# Altium schematic sheet LoraWAN_Node.SchDoc
size 381 x 381 mm; SheetNumber: 1; SheetTotal: 1
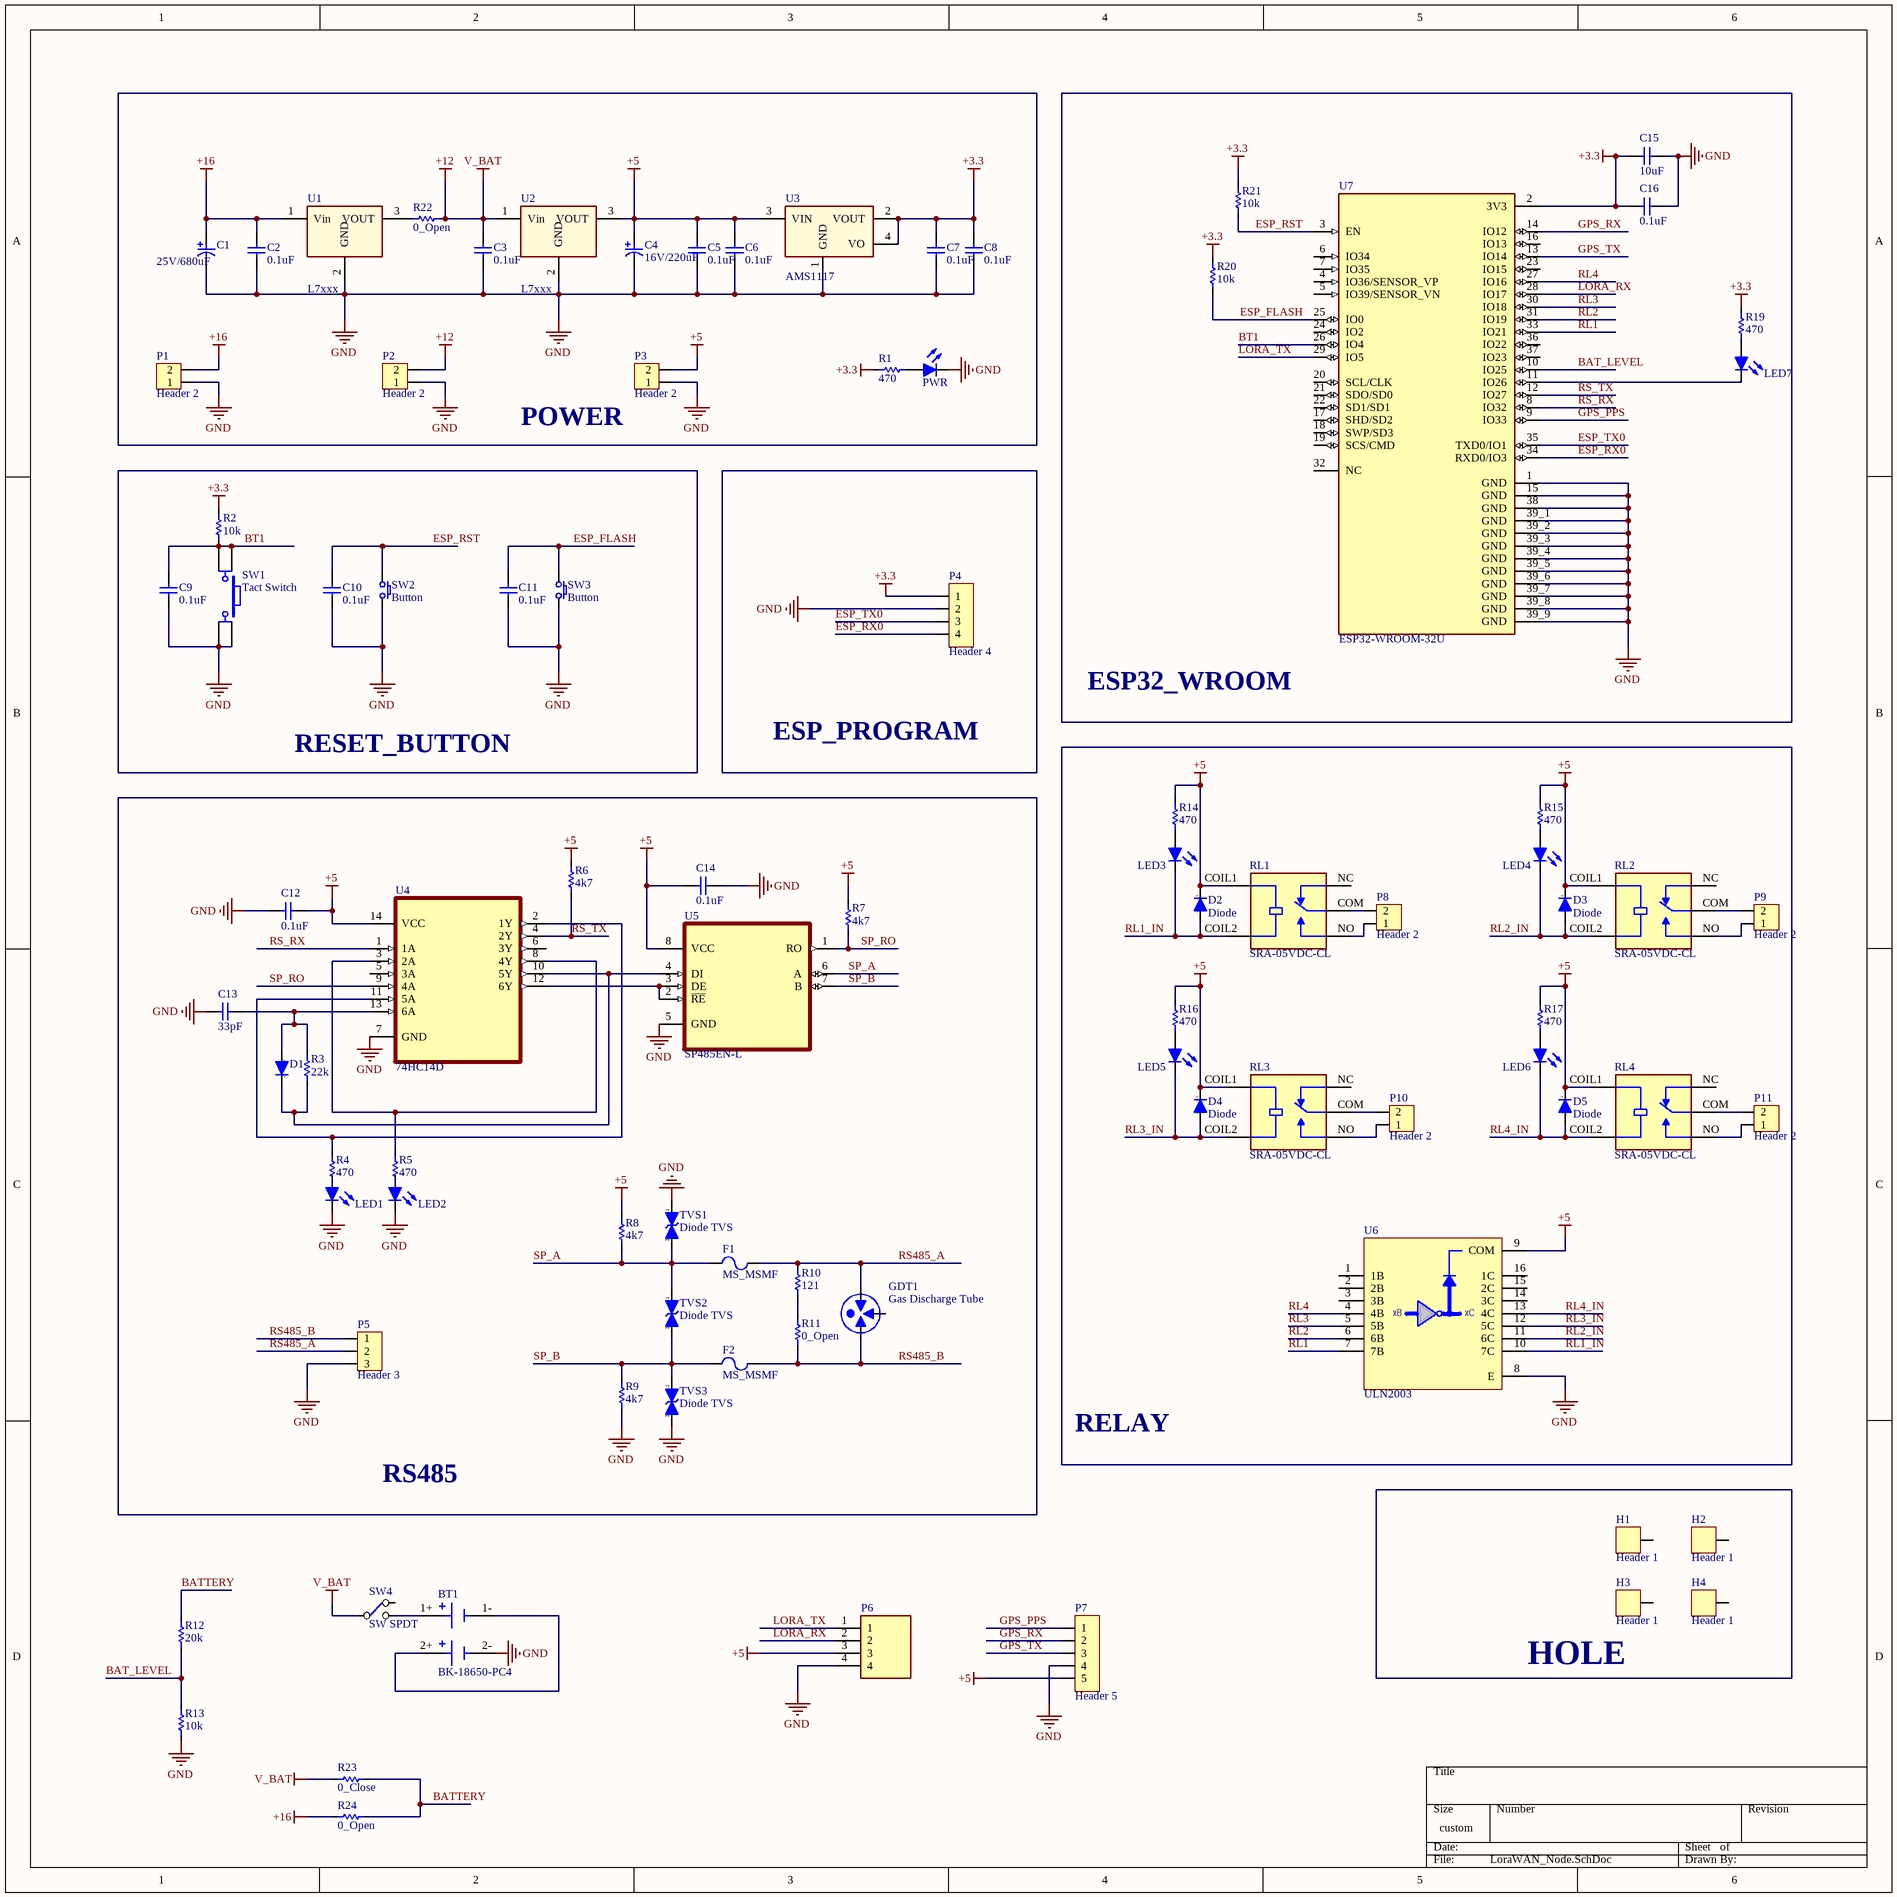
[diagram p0: LoraWAN_Node.SchDoc]

## Parts
BT1  BK-18650-PC4  [BAT_BK-18650-PC4]
C1  25V/680uF  [C SMD ALU (G)]
C2  0.1uF  [C 0603 (1608)]
C3  0.1uF  [C 0603 (1608)]
C4  16V/220uF  [C SMD ALU (D8)]
C5  0.1uF  [C 0603 (1608)]
C6  0.1uF  [C 0603 (1608)]
C7  0.1uF  [C 0603 (1608)]
C8  0.1uF  [C 0603 (1608)]
C9  0.1uF  [C 0603 (1608)]
C10  0.1uF  [C 0603 (1608)]
C11  0.1uF  [C 0603 (1608)]
C12  0.1uF  [C 0603 (1608)]
C13  33pF  [C 0603 (1608)]
C14  0.1uF  [C 0603 (1608)]
C15  10uF  [C 0603 (1608)]
C16  0.1uF  [C 0603 (1608)]
D1  Diode  [DO-214AC (SMA)]  (value not drawn)
D2  Diode  [DO-214AC (SMA)]
D3  Diode  [DO-214AC (SMA)]
D4  Diode  [DO-214AC (SMA)]
D5  Diode  [DO-214AC (SMA)]
F1  MS_MSMF  [Fuse 1812P050]
F2  MS_MSMF  [Fuse 1812P050]
GDT1  Gas Discharge Tube  [CAPC4532X110N]
H1  Header 1  [M3]
H2  Header 1  [M3]
H3  Header 1  [M3]
H4  Header 1  [M3]
LED1  Led  [Led SMD 0805]  (value not drawn)
LED2  Led  [Led SMD 0805]  (value not drawn)
LED3  Led  [Led SMD 0805]  (value not drawn)
LED4  Led  [Led SMD 0805]  (value not drawn)
LED5  Led  [Led SMD 0805]  (value not drawn)
LED6  Led  [Led SMD 0805]  (value not drawn)
LED7  Led  [Led SMD 0805]  (value not drawn)
P1  Header 2  [XH2.54-2P]
P2  Header 2  [HDR Domino 2 - 5MM]
P3  Header 2  [HDR Domino 2 - 5MM]
P4  Header 4  [Header 4]
P5  Header 3  [HDR Domino 3 - 5MM]
P6  110990030  [SEEED_110990030]  (value not drawn)
P7  Header 5  [Header 5]
P8  Header 2  [HDR Domino 2 - 5MM]
P9  Header 2  [HDR Domino 2 - 5MM]
P10  Header 2  [HDR Domino 2 - 5MM]
P11  Header 2  [HDR Domino 2 - 5MM]
PWR  Led  [Led SMD 0805]  (value not drawn)
R1  470  [R 0603 (1608)]
R2  10k  [R 0603 (1608)]
R3  22k  [R 0603 (1608)]
R4  470  [R 0603 (1608)]
R5  470  [R 0603 (1608)]
R6  4k7  [R 0603 (1608)]
R7  4k7  [R 0603 (1608)]
R8  4k7  [R 0603 (1608)]
R9  4k7  [R 0603 (1608)]
R10  121  [R 0603 (1608)]
R11  0_Open  [R 0603 (1608)]
R12  20k  [R 0603 (1608)]
R13  10k  [R 0603 (1608)]
R14  470  [R 0603 (1608)]
R15  470  [R 0603 (1608)]
R16  470  [R 0603 (1608)]
R17  470  [R 0603 (1608)]
R19  470  [R 0603 (1608)]
R20  10k  [R 0603 (1608)]
R21  10k  [R 0603 (1608)]
R22  0_Open  [R 0603 (1608)]
R23  0_Close  [R 0603 (1608)]
R24  0_Open  [R 0603 (1608)]
RL1  SRA-05VDC-CL  [RELAY_SRA-05VDC-CL]
RL2  SRA-05VDC-CL  [RELAY_SRA-05VDC-CL]
RL3  SRA-05VDC-CL  [RELAY_SRA-05VDC-CL]
RL4  SRA-05VDC-CL  [RELAY_SRA-05VDC-CL]
SW1  Tact Switch  [SW/4/DIP/SMALL]
SW2  Button  [SW/2/SMD]
SW3  Button  [SW/2/SMD]
SW4  SW SPDT  [SW/3/SPDT/SS12D10]
TVS1  Diode TVS  [DO-214AA (SMB)]
TVS2  Diode TVS  [DO-214AA (SMB)]
TVS3  Diode TVS  [DO-214AA (SMB)]
U1  L7xxx  [TO-263 (D2PAK)]
U2  L7xxx  [TO-263 (D2PAK)]
U3  AMS1117  [SOT-223]
U4  74HC14D  [SOIC127P600X175-14N]
U5  SP485EN-L  [SOIC-8]
U6  ULN2003  [SOIC-16]
U7  ESP32-WROOM-32U  [XCVR_ESP32-WROOM-32U]

## Nets
+3.3: C7.1 C8.1 C15.1 C16.1 P4.1 R1.2 R2.2 R19.2 R20.2 R21.2 U3.2(VOUT) U3.4(VO) U7.2(3V3)
+5: C4.1 C5.1 C6.1 C12.2 C14.1 D2.1(Cathode) D3.1(Cathode) D4.1(Cathode) D5.1(Cathode) P3.2 P6.3 P7.5 R6.2 R7.2 R8.2 R14.2 R15.2 R16.2 R17.2 RL1.COIL1 RL2.COIL1 RL3.COIL1 RL4.COIL1 U2.3(VOUT) U3.3(VIN) U4.14(VCC) U5.8(VCC) U6.9(COM)
+12: C3.1 P2.2 R22.1 R23.2 SW4.2(COMMON1) U2.1(Vin)  [also labelled V_BAT]
+16: C1.1 C2.1 P1.2 R24.2 U1.1(Vin)
GND: BT1.2- C1.2 C2.2 C3.2 C4.2 C5.2 C6.2 C7.2 C8.2 C9.2 C10.2 C11.2 C12.1 C13.1 C14.2 C15.2 C16.2 LED1.1(K) LED2.1(K) P1.1 P2.1 P3.1 P4.2 P5.3 P6.4 P7.4 PWR.1(K) R9.1 R13.1 SW1.2 SW1.3 SW2.2 SW3.2 TVS1.1(A) TVS3.2(K) U1.2(GND) U2.2(GND) U3.1(GND) U4.7(GND) U5.5(GND) U6.8(E) U7.1(GND) U7.15(GND) U7.38(GND) U7.39_1(GND) U7.39_2(GND) U7.39_3(GND) U7.39_4(GND) U7.39_5(GND) U7.39_6(GND) U7.39_7(GND) U7.39_8(GND) U7.39_9(GND)
BAT_LEVEL: R12.1 R13.2 U7.10(IO25)
BATTERY: R12.2 R23.1 R24.1
BT1: C9.1 R2.1 SW1.1 SW1.4 U7.26(IO4)
ESP_FLASH: C11.1 R20.1 SW3.1 U7.25(IO0)
ESP_RST: C10.1 R21.1 SW2.1 U7.3(EN)
ESP_RX0: P4.4 U7.34(RXD0/IO3)
ESP_TX0: P4.3 U7.35(TXD0/IO1)
GPS_PPS: P7.1 U7.9(IO33)
GPS_RX: P7.2 U7.14(IO12)
GPS_TX: P7.3 U7.13(IO14)
LORA_RX: P6.2 U7.28(IO17)
LORA_TX: P6.1 U7.29(IO5)
RL1: U6.7(7B) U7.33(IO21)
RL1_IN: D2.2(Anode) LED3.1(K) RL1.COIL2 U6.10(7C)
RL2: U6.6(6B) U7.31(IO19)
RL2_IN: D3.2(Anode) LED4.1(K) RL2.COIL2 U6.11(6C)
RL3: U6.5(5B) U7.30(IO18)
RL3_IN: D4.2(Anode) LED5.1(K) RL3.COIL2 U6.12(5C)
RL4: U6.4(4B) U7.27(IO16)
RL4_IN: D5.2(Anode) LED6.1(K) RL4.COIL2 U6.13(4C)
RS485_A: F1.2 GDT1.1 P5.2 R10.1
RS485_B: F2.2 GDT1.2 P5.1 R11.2
RS_RX: U4.1(1A) U7.8(IO32)
RS_TX: R6.1 U4.4(2Y) U7.12(IO27)
SP_A: F1.1 R8.1 TVS1.2(K) TVS2.1(A) U5.6(A)
SP_B: F2.1 R9.2 TVS2.2(K) TVS3.1(A) U5.7(B)
SP_RO: R7.1 U4.9(4A) U5.1(RO)
NetBT1_1+: BT1.1+ SW4.3(NO1)
NetBT1_1-: BT1.1- BT1.2+
NetC13_2: C13.2 D1.2(Anode) R3.2 U4.13(6A)
NetD1_1: D1.1(Cathode) R3.1 U4.10(5Y) U5.4(DI)
NetLED1_2: LED1.2(A) R4.1
NetLED2_2: LED2.2(A) R5.1
NetLED3_2: LED3.2(A) R14.1
NetLED4_2: LED4.2(A) R15.1
NetLED5_2: LED5.2(A) R16.1
NetLED6_2: LED6.2(A) R17.1
NetLED7_1: LED7.1(K) U7.11(IO26)
NetLED7_2: LED7.2(A) R19.1
NetP8_1: P8.1 RL1.NO
NetP8_2: P8.2 RL1.COM
NetP9_1: P9.1 RL2.NO
NetP9_2: P9.2 RL2.COM
NetP10_1: P10.1 RL3.NO
NetP10_2: P10.2 RL3.COM
NetP11_1: P11.1 RL4.NO
NetP11_2: P11.2 RL4.COM
NetPWR_2: PWR.2(A) R1.1
NetR4_2: R4.2 U4.2(1Y) U4.11(5A)
NetR5_2: R5.2 U4.3(2A) U4.8(4Y)
NetR10_2: R10.2 R11.1
NetR22_2: R22.2 U1.3(VOUT)
NetU4_12: U4.12(6Y) U5.2(~{RE}) U5.3(DE)

Not connected (* = marked no-connect by the designer): GDT1 3; H1 1; H2 1; H3 1; H4 1; RL1 NC; RL2 NC; RL3 NC; RL4 NC; SW4 1(NC1); U4 5(3A) 6(3Y); U6 1(1B) 2(2B) 3(3B) 14(3C) 15(2C) 16(1C); U7 4(IO36/SENSOR_VP) 5(IO39/SENSOR_VN) 6(IO34) 7(IO35) 16(IO13) 17(SHD/SD2) 18(SWP/SD3) 19(SCS/CMD) 20(SCL/CLK) 21(SDO/SD0) 22(SD1/SD1) 23(IO15) 24(IO2) 32(NC) 36(IO22) 37(IO23)

## Notes on the sheet
- POWER
- ESP32_WROOM
- RESET_BUTTON
- ESP_PROGRAM
- RELAY
- RS485
- HOLE
- (in symbol Diode) k; a
- (in symbol ULN2003) xB; xC

## Library data of the parts
BT1 = BK-18650-PC4: Battery Holder (Open) 18650 2 Cell PC Pin; Price: None; Value: *; Package: None; Availability: Unavailable; MP: BK-18650-PC4
C1 C4 = Capacitor: Capacitor pol
C2 C3 C5-C16 = Capacitor NP: Capacitor non-pol
D1-D5 = Diode: Default Diode; Published: 8-Jun-2000; LatestRevisionDate: 17-Jul-2002; LatestRevisionNote: Re-released for DXP Platform.; PackageVersion: Sep-1996; PackageReference: SMC; Publisher: Altium Limited; Code_JEDEC: DO-214-AB
F1 F2 = Fuse
H1-H4 = Header 1: Header, 1-Pin; LatestRevisionDate: 17-Jul-2002; LatestRevisionNote: Re-released for DXP Platform.; Publisher: Altium Limited
LED1-LED7 PWR = Led: Typical LED
P1-P3 P8-P11 = Header 2: Header, 2-Pin; LatestRevisionDate: 17-Jul-2002; LatestRevisionNote: Re-released for DXP Platform.; Publisher: Altium Limited
P4 = Header 4: Header, 4-Pin
P5 = Header 3: Header, 3-Pin
P6 = 110990030: MF: Seeed Technology; Arrow_Electronics-Purchase-URL: https://snapeda.com/shop?store=Arrow+Electronics&id=583576; Availability: Good; Package: None; Price: None; Mouser-Purchase-URL: https://snapeda.com/shop?store=Mouser&id=583576; MP: 110990030; SnapEDA_Link: https://www.snapeda.com/parts/110990030/Seeed%20Technology%20Co.,%20Ltd/view-part/583576/?ref=snap; Value: *; Check_prices: https://www.snapeda.com/parts/110990030/Seeed%20Technology%20Co.,%20Ltd/view-part/583576/?ref=eda
P7 = Header 5: Header, 5-Pin; LatestRevisionDate: 17-Jul-2002; LatestRevisionNote: Re-released for DXP Platform.; Publisher: Altium Limited
R1-R17 R19-R24 = Resistor: Published: 8-Jun-2000; LatestRevisionDate: 17-Jul-2002; LatestRevisionNote: Re-released for DXP Platform.; PackageReference: AXIAL-0.3; Publisher: Altium Limited
RL1-RL4 = SRA-05VDC-CL: MF: Songle Relay; SnapEDA_Link: https://www.snapeda.com/parts/SRA-05VDC-CL/Songle+Relay/view-part/?ref=snap; Package: Package; Value: *; MP: SRA-05VDC-CL; Check_prices: https://www.snapeda.com/parts/SRA-05VDC-CL/Songle+Relay/view-part/?ref=eda
SW1 = SW SPST-4: Tact switch 4 pin
SW2 SW3 = SW SPST: Tact switch 2 pin
TVS1-TVS3 = Diode TVS Bi-Dir: Bi-directional TVS Diode; Published: 8-Jun-2000; LatestRevisionDate: 17-Jul-2002; LatestRevisionNote: Re-released for DXP Platform.; PackageReference: DIODE-0.7; Publisher: Altium Limited
U1 U2 = L7xxx: LDO Fixed Voltage regulator
U3 = AMS1117: 1A LDO Voltage Regulator, ADJ or fixed 1.5/1.8/2.5/2.85/3.3/5V
U4 = 74HC14D: Inverter IC 6 Channel Schmitt Trigger 14-SOIC; MF: Toshiba; SnapEDA_Link: https://www.snapeda.com/parts/74HC14D/Toshiba+Semiconductor+and+Storage/view-part/?ref=snap; Availability: In Stock; Price: None; Package: SO14-14 Nexperia USA Inc.; Purchase-URL: https://pricing.snapeda.com/search/part/74HC14D/?ref=eda; Check_prices: https://www.snapeda.com/parts/74HC14D/Toshiba+Semiconductor+and+Storage/view-part/?ref=eda; Value: *; MP: 74HC14D
U5 = SP485EN-L: SP485 Series 5 Mbps 5 V Low Power Half Duplex RS-485 Transceiver - NSOIC-8; MF: MaxLinear, Inc.; MP: SP485EN-L; SnapEDA_Link: https://www.snapeda.com/parts/SP485EN-L/MaxLinear%252C+Inc./view-part/?ref=snap; Availability: In Stock; Package: SOIC-8 Exar; Check_prices: https://www.snapeda.com/parts/SP485EN-L/MaxLinear%252C+Inc./view-part/?ref=eda; Value: *; Purchase-URL: https://pricing.snapeda.com/search/part/SP485EN-L/?ref=eda; Price: None
U6 = ULN2003: High-voltage, high-current Darlington transistor arrays
U7 = ESP32-WROOM-32U: Bluetooth, WiFi 802.11b/g/n, Bluetooth v4.2 +EDR, Class 1, 2 and 3 Transceiver Module 2.4GHz ~ 2.5GHz Antenna Not Included, U.FL Surface Mount; MF: Espressif Systems; SnapEDA_Link: https://www.snapeda.com/parts/ESP32-WROOM-32U/Espressif+Systems/view-part/?ref=snap; Package: NON STANDARD-39 Espressif; Value: *; MP: ESP32-WROOM-32U; Check_prices: https://www.snapeda.com/parts/ESP32-WROOM-32U/Espressif+Systems/view-part/?ref=eda